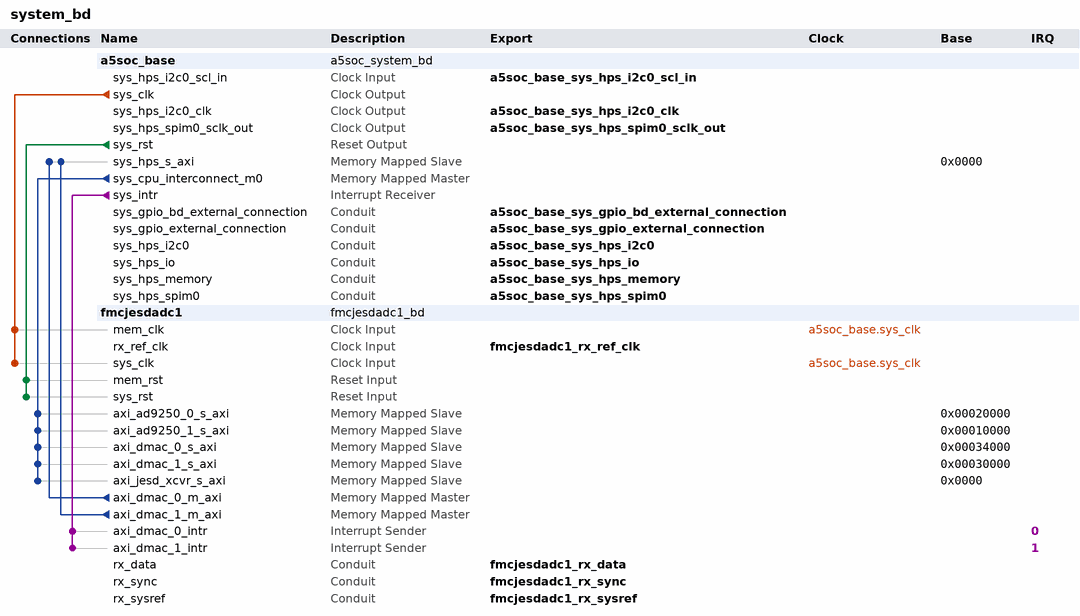
[diagram p0: system contents]
# Platform Designer (Qsys) system system_bd, Arria V 5ASTFD5K3F40I3ES
# Parameters at their usual value, and those the tool derives, are not listed.
package require qsys
create_system system_bd
set_project_property DEVICE_FAMILY {Arria V}
set_project_property DEVICE 5ASTFD5K3F40I3ES

add_instance a5soc_base a5soc_system_bd 1.0

add_instance fmcjesdadc1 fmcjesdadc1_bd 1.0

# connections
add_connection a5soc_base.sys_clk fmcjesdadc1.mem_clk clock
add_connection a5soc_base.sys_clk fmcjesdadc1.sys_clk clock
add_connection a5soc_base.sys_rst fmcjesdadc1.mem_rst reset
add_connection a5soc_base.sys_rst fmcjesdadc1.sys_rst reset
add_connection a5soc_base.sys_cpu_interconnect_m0 fmcjesdadc1.axi_ad9250_0_s_axi avalon
set_connection_parameter_value a5soc_base.sys_cpu_interconnect_m0/fmcjesdadc1.axi_ad9250_0_s_axi baseAddress 0x00020000
add_connection a5soc_base.sys_cpu_interconnect_m0 fmcjesdadc1.axi_ad9250_1_s_axi avalon
set_connection_parameter_value a5soc_base.sys_cpu_interconnect_m0/fmcjesdadc1.axi_ad9250_1_s_axi baseAddress 0x00010000
add_connection a5soc_base.sys_cpu_interconnect_m0 fmcjesdadc1.axi_dmac_0_s_axi avalon
set_connection_parameter_value a5soc_base.sys_cpu_interconnect_m0/fmcjesdadc1.axi_dmac_0_s_axi baseAddress 0x00034000
add_connection a5soc_base.sys_cpu_interconnect_m0 fmcjesdadc1.axi_dmac_1_s_axi avalon
set_connection_parameter_value a5soc_base.sys_cpu_interconnect_m0/fmcjesdadc1.axi_dmac_1_s_axi baseAddress 0x00030000
add_connection a5soc_base.sys_cpu_interconnect_m0 fmcjesdadc1.axi_jesd_xcvr_s_axi avalon
set_connection_parameter_value a5soc_base.sys_cpu_interconnect_m0/fmcjesdadc1.axi_jesd_xcvr_s_axi baseAddress 0x0000
add_connection fmcjesdadc1.axi_dmac_0_m_axi a5soc_base.sys_hps_s_axi avalon
set_connection_parameter_value fmcjesdadc1.axi_dmac_0_m_axi/a5soc_base.sys_hps_s_axi baseAddress 0x0000
add_connection fmcjesdadc1.axi_dmac_1_m_axi a5soc_base.sys_hps_s_axi avalon
set_connection_parameter_value fmcjesdadc1.axi_dmac_1_m_axi/a5soc_base.sys_hps_s_axi baseAddress 0x0000
add_connection a5soc_base.sys_intr fmcjesdadc1.axi_dmac_0_intr interrupt
set_connection_parameter_value a5soc_base.sys_intr/fmcjesdadc1.axi_dmac_0_intr irqNumber 0
add_connection a5soc_base.sys_intr fmcjesdadc1.axi_dmac_1_intr interrupt
set_connection_parameter_value a5soc_base.sys_intr/fmcjesdadc1.axi_dmac_1_intr irqNumber 1

# exported interfaces
add_interface a5soc_base_sys_gpio_bd_external_connection conduit end
set_interface_property a5soc_base_sys_gpio_bd_external_connection EXPORT_OF a5soc_base.sys_gpio_bd_external_connection
add_interface a5soc_base_sys_gpio_external_connection conduit end
set_interface_property a5soc_base_sys_gpio_external_connection EXPORT_OF a5soc_base.sys_gpio_external_connection
add_interface a5soc_base_sys_hps_i2c0 conduit end
set_interface_property a5soc_base_sys_hps_i2c0 EXPORT_OF a5soc_base.sys_hps_i2c0
add_interface a5soc_base_sys_hps_i2c0_clk clock source
set_interface_property a5soc_base_sys_hps_i2c0_clk EXPORT_OF a5soc_base.sys_hps_i2c0_clk
add_interface a5soc_base_sys_hps_i2c0_scl_in clock sink
set_interface_property a5soc_base_sys_hps_i2c0_scl_in EXPORT_OF a5soc_base.sys_hps_i2c0_scl_in
add_interface a5soc_base_sys_hps_io conduit end
set_interface_property a5soc_base_sys_hps_io EXPORT_OF a5soc_base.sys_hps_io
add_interface a5soc_base_sys_hps_memory conduit end
set_interface_property a5soc_base_sys_hps_memory EXPORT_OF a5soc_base.sys_hps_memory
add_interface a5soc_base_sys_hps_spim0 conduit end
set_interface_property a5soc_base_sys_hps_spim0 EXPORT_OF a5soc_base.sys_hps_spim0
add_interface a5soc_base_sys_hps_spim0_sclk_out clock source
set_interface_property a5soc_base_sys_hps_spim0_sclk_out EXPORT_OF a5soc_base.sys_hps_spim0_sclk_out
add_interface fmcjesdadc1_rx_data conduit end
set_interface_property fmcjesdadc1_rx_data EXPORT_OF fmcjesdadc1.rx_data
add_interface fmcjesdadc1_rx_ref_clk clock sink
set_interface_property fmcjesdadc1_rx_ref_clk EXPORT_OF fmcjesdadc1.rx_ref_clk
add_interface fmcjesdadc1_rx_sync conduit end
set_interface_property fmcjesdadc1_rx_sync EXPORT_OF fmcjesdadc1.rx_sync
add_interface fmcjesdadc1_rx_sysref conduit end
set_interface_property fmcjesdadc1_rx_sysref EXPORT_OF fmcjesdadc1.rx_sysref

set_interconnect_requirement {$system} qsys_mm.clockCrossingAdapter FIFO
set_interconnect_requirement {$system} qsys_mm.insertDefaultSlave FALSE
set_interconnect_requirement {$system} qsys_mm.maxAdditionalLatency 2

save_system system_bd.qsys
